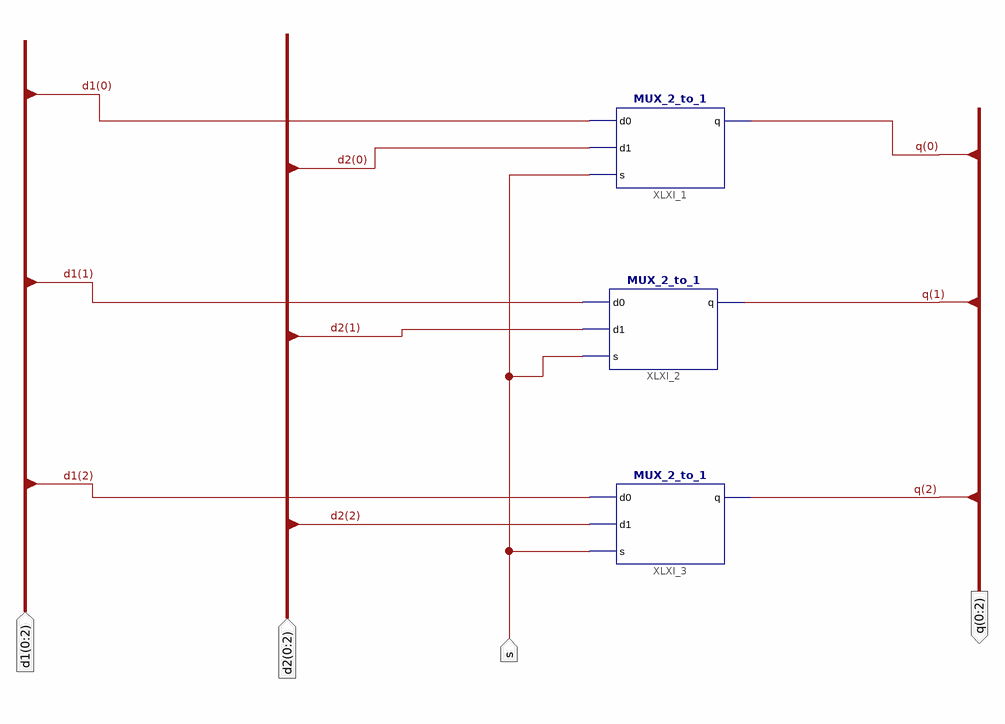
[diagram p0: schematic sheet 1]
// Xilinx ISE schematic MUX_2_WAY_3_BIT.sch (spartan3e) as structural Verilog: 3 symbols, 4 ports
module MUX_2_WAY_3_BIT (
  input  [0:2] d1,
  input  [0:2] d2,
  input  s,
  output [0:2] q
);

  MUX_2_to_1 XLXI_1 (.d0(d1[0]), .d1(d2[0]), .s(s), .q(q[0]));
  MUX_2_to_1 XLXI_2 (.d0(d1[1]), .d1(d2[1]), .s(s), .q(q[1]));
  MUX_2_to_1 XLXI_3 (.d0(d1[2]), .d1(d2[2]), .s(s), .q(q[2]));
endmodule
